# Altium schematic sheet DAC&DifferenceAmp.SchDoc
size A; SheetNumber: 1; SheetTotal: 2
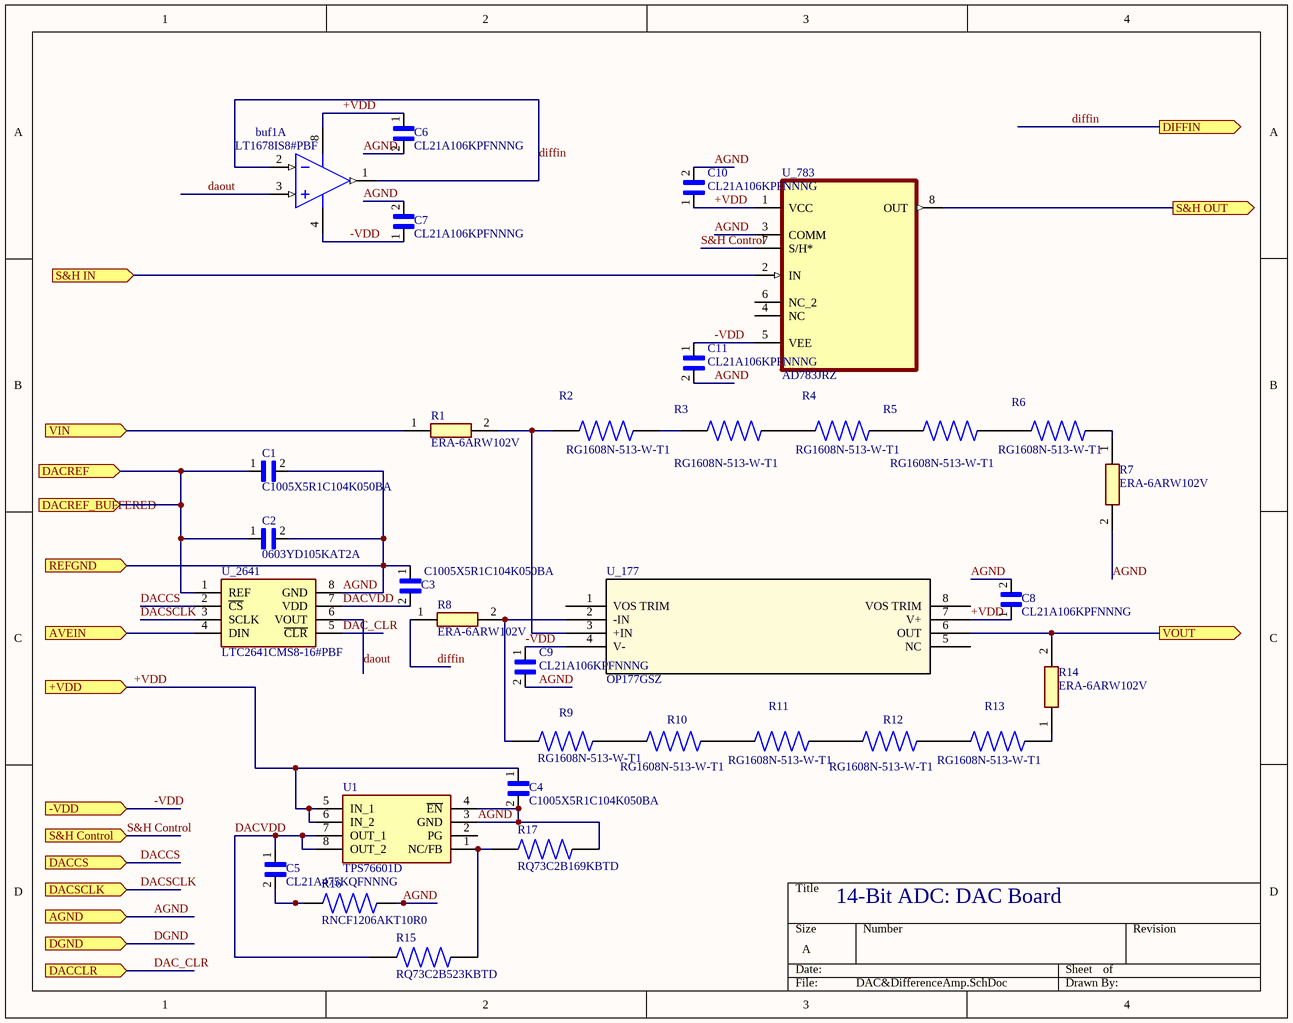
[diagram p0: DAC&DifferenceAmp.SchDoc]

## Parts
buf1  LT1678IS8#PBF  [LT-S8-8_L]  (part A of 2)
C1  C1005X5R1C104K050BA  [CAPC1005X55N]
C2  0603YD105KAT2A  [CAPC1608X90N]
C3  C1005X5R1C104K050BA  [CAPC1005X55N]
C4  C1005X5R1C104K050BA  [CAPC1005X55N]
C5  CL21A475KQFNNNG  [CAPC2012X135N]
C6  CL21A106KPFNNNG  [CAPC2012X135N]
C7  CL21A106KPFNNNG  [CAPC2012X135N]
C8  CL21A106KPFNNNG  [CAPC2012X135N]
C9  CL21A106KPFNNNG  [CAPC2012X135N]
C10  CL21A106KPFNNNG  [CAPC2012X135N]
C11  CL21A106KPFNNNG  [CAPC2012X135N]
R1  ERA-6ARW102V  [ERA6A_(0805)]
R2  RG1608N-513-W-T1  [RESC1608X50N]
R3  RG1608N-513-W-T1  [RESC1608X50N]
R4  RG1608N-513-W-T1  [RESC1608X50N]
R5  RG1608N-513-W-T1  [RESC1608X50N]
R6  RG1608N-513-W-T1  [RESC1608X50N]
R7  ERA-6ARW102V  [ERA6A_(0805)]
R8  ERA-6ARW102V  [ERA6A_(0805)]
R9  RG1608N-513-W-T1  [RESC1608X50N]
R10  RG1608N-513-W-T1  [RESC1608X50N]
R11  RG1608N-513-W-T1  [RESC1608X50N]
R12  RG1608N-513-W-T1  [RESC1608X50N]
R13  RG1608N-513-W-T1  [RESC1608X50N]
R14  ERA-6ARW102V  [ERA6A_(0805)]
R15  RQ73C2B523KBTD  [RESC3116X75N]
R16  RNCF1206AKT10R0  [RESC3015X65N]
R17  RQ73C2B169KBTD  [RESC3116X75N]
U1  TPS76601D  [SOIC127P600X175-8N]
U_177  OP177GSZ  [R_8_ADI]
U_783  AD783JRZ  [SOIC127P600X272-8N]
U_2641  LTC2641CMS8-16#PBF  [SOP65P490X110-8N]

## Ports
+VDD (in), -VDD (in), AGND (in), AVEIN (in), DACCLR (in), DACCS (in), DACREF (in), DACREF_BUFFERED (in), DACSCLK (in), DGND (in), DIFFIN (out), REFGND (in), S&H Control (in), S&H IN (in), S&H OUT (out), VIN (in), VOUT (out)

## Nets
+VDD: buf1.8(V+) C4.1 C6.1 C8.1 C10.1 U1.5(IN_1) U1.6(IN_2) U_177.7(V+) U_783.1(VCC) ; port +VDD
-VDD: buf1.4(V-) C7.1 C9.1 C11.1 U_177.4(V-) U_783.5(VEE) ; port -VDD
AGND: C1.2 C2.2 C3.1 C4.2 C6.2 C7.2 C8.2 C9.2 C10.2 C11.2 R7.2 R16.2 R17.2 U1.3(GND) U1.4(~{EN}) U_783.3(COMM) U_2641.8(GND) ; port AGND, port REFGND
AVEIN: U_2641.4(DIN) ; port AVEIN
DAC_CLR: U_2641.5(~{CLR}) ; port DACCLR
DACCS: U_2641.2(~{CS}) ; port DACCS
DACREF: C1.1 C2.1 U_2641.1(REF) ; port DACREF, port DACREF_BUFFERED
DACSCLK: U_2641.3(SCLK) ; port DACSCLK
DACVDD: C3.2 C5.1 R15.1 U1.7(OUT_1) U1.8(OUT_2) U_2641.7(VDD)
daout: buf1.3(+IN_A) U_2641.6(VOUT)
DGND: port DGND
diffin: buf1.1(OUT_A) buf1.2(-IN_A) R8.1 ; port DIFFIN
S&H Control: U_783.7(S/H*) ; port S&H Control
S&H IN: U_783.2(IN) ; port S&H IN
S&H OUT: U_783.8(OUT) ; port S&H OUT
VIN: R1.1 ; port VIN
VOUT: R14.2 U_177.6(OUT) ; port VOUT
NetC5_2: C5.2 R16.1
NetR1_2: R1.2 R2.1 U_177.3(+IN)
NetR2_2: R2.2 R3.1
NetR3_2: R3.2 R4.1
NetR4_2: R4.2 R5.1
NetR5_2: R5.2 R6.1
NetR6_2: R6.2 R7.1
NetR8_2: R8.2 R9.1 U_177.2(-IN)
NetR9_2: R9.2 R10.1
NetR10_2: R10.2 R11.1
NetR11_2: R11.2 R12.1
NetR12_2: R12.2 R13.1
NetR13_2: R13.2 R14.1
NetR15_2: R15.2 R17.1 U1.1(NC/FB)

Not connected (* = marked no-connect by the designer): U1 2(PG); U_177 1(VOS_TRIM) 5(NC) 8(VOS_TRIM); U_783 4(NC) 6(NC_2)

## Notes on the sheet
- 14-Bit ADC: DAC Board

## Library data of the parts
buf1 = CMP-0359-03474-2: Dual Channel, Very Low 1/f Corner Frequency Precision Operational Amplifier, 20 MHz Typical GBW, 6 V/us Typical SR, 3 to 36 V, 8-Pin SOIC (S8-8), Industrial, Pb-Free; Linear Technology Part Number: LT1678; Manufacturer: Linear Technology; Channels (#): 2; Vs Max (V): 36; Vos (mV) Typical: 0.035; SR (V/us) Typical: 6; Vs Min (V): 3; Vos (mV) Guaranteed: 0.1; GBW (MHz) Typical: 20; Mounting Technology: Surface Mount; ComponentLink3URL: http://cds.linear.com/docs/en/packaging/05081610_G_SO8.pdf; PackageDescription: 8-Pin Plastic Small Outline, Body 4.9 x 3.9 mm, Pitch 1.27 mm; ComponentLink2URL: http://cds.linear.com/docs/en/datasheet/16789fs.pdf; RevisionNote: URLs updated; Is (mA) Typical: 2; RoHS: Pb-Free; ComponentLink1URL: http://www.linear.com/; ComponentLink1Description: Manufacturer URL; PackageReference: LT-S8-8; PackageVersion: Rev G; ComponentLink3Description: Package Specification; Type: VFB; PartNumber: LT1678IS8#PBF; ComponentLink2Description: Datasheet
C1 C3 C4 = C1005X5R1C104K050BA: CERAMIC CAPACITOR, 0.1UF, 16V, X5R, 10%, 0402; Package: None; Price: None; Value: *; MP: C1005X5R1C104K050BA; Availability: Unavailable
C2 = 0603YD105KAT2A: 1ÂµF Â±10% 16V Ceramic Capacitor X5R 0603 (1608 Metric); MF: AVX; SnapEDA_Link: https://www.snapeda.com/parts/0603YD105KAT2A/AVX%20/%20Kyocera/view-part/270397/?ref=snap; Value: *; Availability: Unavailable; Price: None; MP: 0603YD105KAT2A; Package: 1608 AVX; DigiKey-Purchase-URL: https://snapeda.com/shop?store=DigiKey&id=270397
C5 = CL21A475KQFNNNG: 4.7U 6.3V K0805 X5R; Package: None; Price: None; Value: *; MP: CL21A475KQFNNNG; Availability: Unavailable
C6-C11 = CL21A106KPFNNNG: 10ÂµF Â±10% 10V Ceramic Capacitor X5R 0805 (2012 Metric); MF: Samsung Electro-Mechanics; SnapEDA_Link: https://www.snapeda.com/parts/CL21A106KPFNNNG/Samsung%20Electro-Mechanics/view-part/3598324/?ref=snap; Value: *; Arrow_Electronics-Purchase-URL: https://snapeda.com/shop?store=Arrow+Electronics&id=3598324; Digi-Key_Part_Number: 1276-6456-1-ND; Mouser-Purchase-URL: https://snapeda.com/shop?store=Mouser&id=3598324; MP: CL21A106KPFNNNG; Package: 0805 Samsung; DigiKey-Purchase-URL: https://snapeda.com/shop?store=DigiKey&id=3598324
R1 R7 R8 R14 = ERA-6ARW102V: Resistor; Manufacturer_Name: Panasonic; Datasheet Link: http://industrial.panasonic.com/cdbs/www-data/pdf/RDM0000/AOA0000C307.pdf; Height: 0.6mm; Manufacturer_Part_Number: ERA-6ARW102V
U1 = TPS76601D: Integrated Circuit; Manufacturer_Name: Texas Instruments; Datasheet Link: https://www.ti.com/lit/ds/symlink/tps766.pdf?ts=1633601131788&ref_url=https%253A%252F%252Fwww.ti.com%252Fstore%252Fti%252Fen%252Fp%252Fproduct%252F%253Fp%253DTPS76601D%2526keyMatch%253DTPS76601D%2526tisearch%253Dsearch-everything%2526usecase%253DOPN; Height: 1.75mm; Manufacturer_Part_Number: TPS76601D; Mouser Part Number: 595-TPS76601D; Mouser Price/Stock: https://www.mouser.co.uk/ProductDetail/Texas-Instruments/TPS76601D?qs=6zVL%252ByCp0mox2N1yVKwG6w%3D%3D
U_177 = OP177GSZ: No Description Available; Vendor: Analog Devices Inc; Built_By: EMA_UL_Team; SourceLibrary: Analog_2012-01-01_9; Manufacturer_Part_Number: OP177GSZ; Copyright: Copyright (C) 2021 Accelerated Designs. All rights reserved; RefDes: RefDes; Type: DEV
U_783 = AD783JRZ: Sample and Hold Amplifier 1 Circuit 8-SOIC; MF: Analog Devices; Purchase-URL: https://pricing.snapeda.com/search/part/AD783JRZ/?ref=eda; Check_prices: https://www.snapeda.com/parts/AD783JRZ/Analog%20Devices%20Inc./view-part/353069/?ref=eda; Value: *; SnapEDA_Link: https://www.snapeda.com/parts/AD783JRZ/Analog%20Devices%20Inc./view-part/353069/?ref=snap; Package: SOIC-8 Analog Devices; Availability: Bad; Price: None; MP: AD783JRZ
U_2641 = LTC2641CMS8-16#PBF: Integrated Circuit; Manufacturer_Name: Analog Devices; Datasheet Link: https://www.analog.com/media/en/technical-documentation/data-sheets/26412fd.pdf; Height: 1.1mm; Manufacturer_Part_Number: LTC2641CMS8-16#PBF; Mouser Part Number: 584-C2641CMS8-16PBF; Mouser Price/Stock: https://www.mouser.com/Search/Refine.aspx?Keyword=584-C2641CMS8-16PBF; Arrow Part Number: LTC2641CMS8-16#PBF; Arrow Price/Stock: https://www.arrow.com/en/products/ltc2641cms8-16pbf/analog-devices
R2-R6 R9-R13 = RG1608N-513-W-T1: Package: None; Price: None; Value: *; MP: RG1608N-513-W-T1; Availability: Unavailable
R15 = RQ73C2B523KBTD: Package: None; Price: None; Value: *; MP: RQ73C2B523KBTD; Availability: Unavailable
R16 = RNCF1206AKT10R0: Package: None; Price: None; Value: *; MP: RNCF1206AKT10R0; Availability: Unavailable
R17 = RQ73C2B169KBTD: Package: None; Price: None; Value: *; MP: RQ73C2B169KBTD; Availability: Unavailable